# Altium schematic sheet MAX2871.SchDoc
size A4
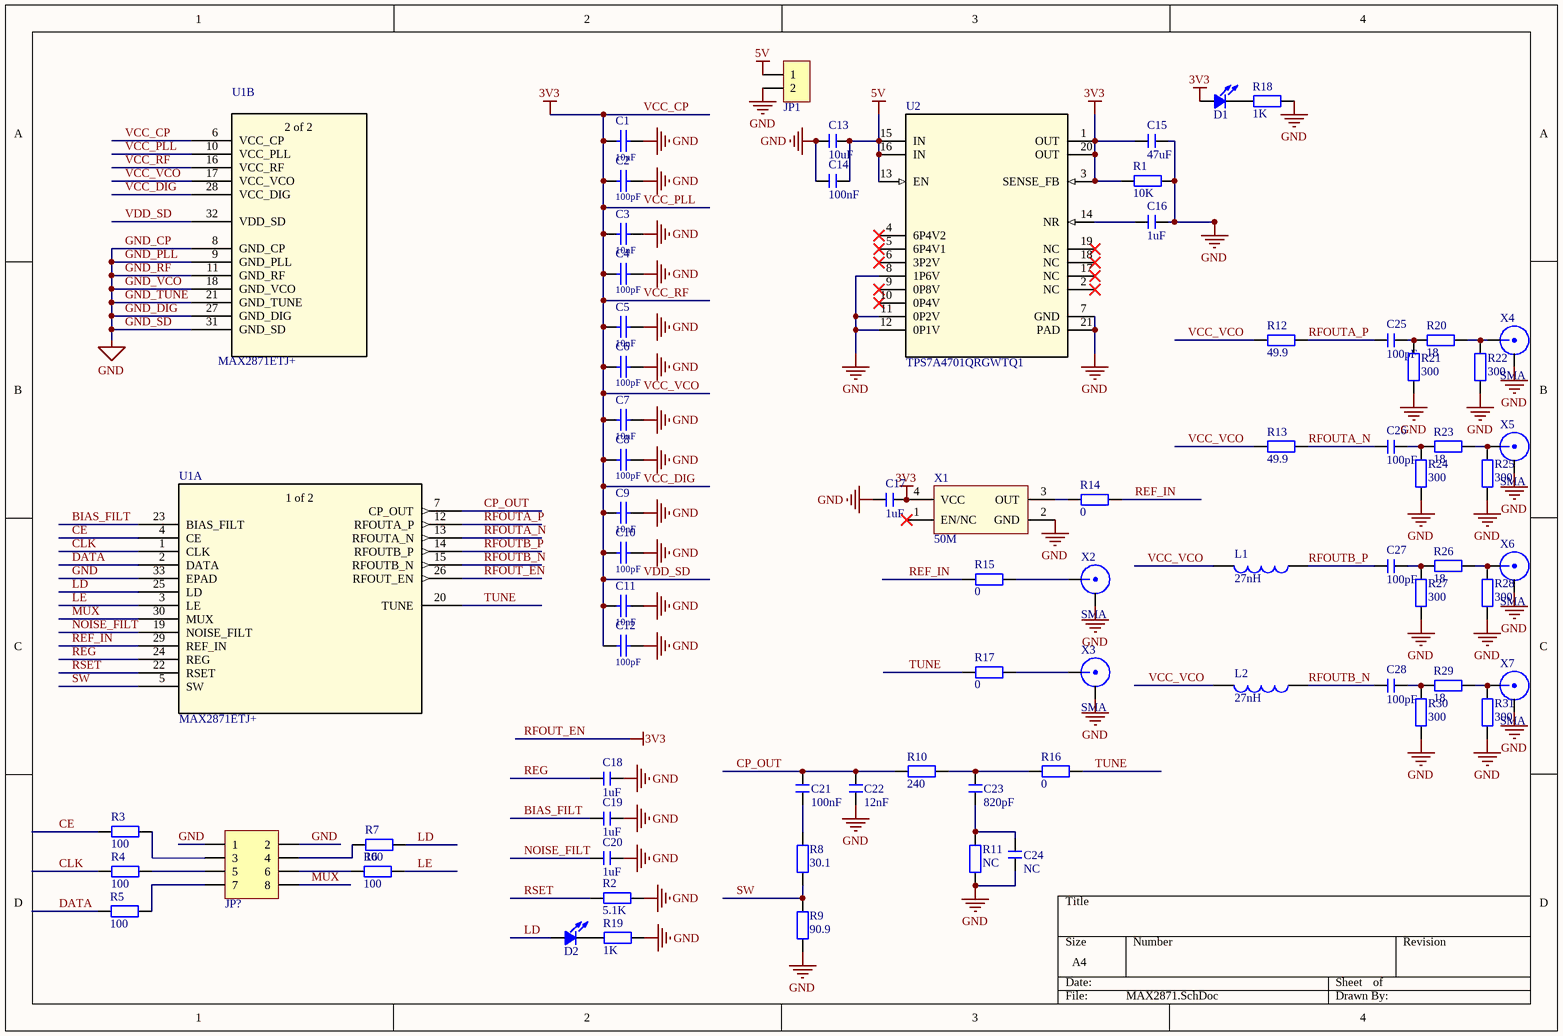
[diagram p0: MAX2871.SchDoc]

## Parts
C1  value 10nF  [C0603-L]  (hidden comment: Cap-S)
C2  value 100pF  [C0603-L]  (hidden comment: Cap-S)
C3  value 10nF  [C0603-L]  (hidden comment: Cap-S)
C4  value 100pF  [C0603-L]  (hidden comment: Cap-S)
C5  value 10nF  [C0603-L]  (hidden comment: Cap-S)
C6  value 100pF  [C0603-L]  (hidden comment: Cap-S)
C7  value 10nF  [C0603-L]  (hidden comment: Cap-S)
C8  value 100pF  [C0603-L]  (hidden comment: Cap-S)
C9  value 10nF  [C0603-L]  (hidden comment: Cap-S)
C10  value 100pF  [C0603-L]  (hidden comment: Cap-S)
C11  value 10nF  [C0603-L]  (hidden comment: Cap-S)
C12  value 100pF  [C0603-L]  (hidden comment: Cap-S)
C13  10uF  [C 0603_L]
C14  100nF  [C 0603_L]
C15  47uF  [C 0603_L]
C16  1uF  [C 0603_L]
C17  1uF  [C 0603_L]
C18  1uF  [C 0603_L]
C19  1uF  [C 0603_L]
C20  1uF  [C 0603_L]
C21  100nF  [C 0603_L]
C22  12nF  [C 0603_L]
C23  820pF  [C 0603_L]
C24  NC  [C 0603_L]
C25  100pF  [C 0603_L]
C26  100pF  [C 0603_L]
C27  100pF  [C 0603_L]
C28  100pF  [C 0603_L]
D1  LED  [Led-0805_L]  (value not drawn)
D2  LED  [Led-0805_L]  (value not drawn)
JP1  HDR-1X2  [VH3.96-LI-2P]  (value not drawn)
JP?  Header 4X2  [HDR2.54-LI-2x4P]  (value not drawn)
L1  27nH  [L 0603]
L2  27nH  [L 0603]
R1  10K  [R 0603_L]
R2  5.1K  [R 0603_L]
R3  100  [R 0603_L]
R4  100  [R 0603_L]
R5  100  [R 0603_L]
R6  100  [R 0603_L]
R7  100  [R 0603_L]
R8  30.1  [R 0603_L]
R9  90.9  [R 0603_L]
R10  240  [R 0603_L]
R11  NC  [R 0603_L]
R12  49.9  [R 0603_L]
R13  49.9  [R 0603_L]
R14  0  [R 0603_L]
R15  0  [R 0603_L]
R16  0  [R 0603_L]
R17  0  [R 0603_L]
R18  1K  [R 0603_L]
R19  1K  [R 0603_L]
R20  18  [R 0603_L]
R21  300  [R 0603_L]
R22  300  [R 0603_L]
R23  18  [R 0603_L]
R24  300  [R 0603_L]
R25  300  [R 0603_L]
R26  18  [R 0603_L]
R27  300  [R 0603_L]
R28  300  [R 0603_L]
R29  18  [R 0603_L]
R30  300  [R 0603_L]
R31  300  [R 0603_L]
U1  MAX2871ETJ+  [21-0140L_T3255-5_MXM]  (parts A,B of 2)
U2  TPS7A4701QRGWTQ1  [RGW0020A]
X1  50M  [OSC 5032-4P]
X2  SMA  [SMA1]
X3  SMA  [SMA1]
X4  SMA  [SMA1]
X5  SMA  [SMA1]
X6  SMA  [SMA1]
X7  SMA  [SMA1]

## Nets
5V: C13.2 C14.2 JP1.1 U2.13(EN) U2.15(IN) U2.16(IN)
GND: C1.2 C2.2 C3.2 C4.2 C5.2 C6.2 C7.2 C8.2 C9.2 C10.2 C11.2 C12.2 C13.1 C14.1 C15.2 C16.2 C17.1 C18.2 C19.2 C20.2 C22.1 C24.1 JP1.2 JP?.1 JP?.2 R1.1 R2.1 R9.2 R11.2 R18.1 R19.1 R21.2 R22.2 R24.2 R25.2 R27.2 R28.2 R30.2 R31.2 U1.8(GND_CP) U1.9(GND_PLL) U1.11(GND_RF) U1.18(GND_VCO) U1.21(GND_TUNE) U1.27(GND_DIG) U1.31(GND_SD) U1.33(EPAD) U2.7(GND) U2.8(1P6V) U2.11(0P2V) U2.12(0P1V) U2.21(PAD) X1.2(GND) X2.2 X3.2 X4.2 X5.2 X6.2 X7.2  [also labelled GND_CP, GND_DIG, GND_PLL, GND_RF, GND_SD, GND_TUNE, GND_VCO]
RFOUT_EN: C1.1 C2.1 C3.1 C4.1 C5.1 C6.1 C7.1 C8.1 C9.1 C10.1 C11.1 C12.1 C15.1 C17.2 D1.1 L1.2 L2.2 R1.2 R12.2 R13.2 U1.6(VCC_CP) U1.10(VCC_PLL) U1.16(VCC_RF) U1.17(VCC_VCO) U1.26(RFOUT_EN) U1.28(VCC_DIG) U1.32(VDD_SD) U2.1(OUT) U2.3(SENSE_FB) U2.20(OUT) X1.4(VCC)  [also labelled 3V3, VCC_CP, VCC_DIG, VCC_PLL, VCC_RF, VCC_VCO, VDD_SD]
BIAS_FILT: C19.1 U1.23(BIAS_FILT)
CE: R3.2 U1.4(CE)
CLK: R4.2 U1.1(CLK)
CP_OUT: C21.2 C22.2 R10.2 U1.7(CP_OUT)
DATA: R5.2 U1.2(DATA)
LD: D2.1 R7.1 U1.25(LD)
LE: R6.1 U1.3(LE)
MUX: JP?.8 U1.30(MUX)
NOISE_FILT: C20.1 U1.19(NOISE_FILT)
REF_IN: R14.1 R15.2 U1.29(REF_IN)
REG: C18.1 U1.24(REG)
RFOUTA_N: C26.1 R13.1 U1.13(RFOUTA_N)
RFOUTA_P: C25.1 R12.1 U1.12(RFOUTA_P)
RFOUTB_N: C28.1 L2.1 U1.15(RFOUTB_N)
RFOUTB_P: C27.1 L1.1 U1.14(RFOUTB_P)
RSET: R2.2 U1.22(RSET)
SW: R8.2 R9.1 U1.5(SW)
TUNE: R16.1 R17.2 U1.20(TUNE)
NetC16_1: C16.1 U2.14(NR)
NetC21_1: C21.1 R8.1
NetC23_1: C23.1 C24.2 R11.1
NetC23_2: C23.2 R10.1 R16.2
NetC25_2: C25.2 R20.2 R21.1
NetC26_2: C26.2 R23.2 R24.1
NetC27_2: C27.2 R26.2 R27.1
NetC28_2: C28.2 R29.2 R30.1
NetD1_2: D1.2 R18.2
NetD2_2: D2.2 R19.2
NetJP?_3: JP?.3 R3.1
NetJP?_4: JP?.4 R7.2
NetJP?_5: JP?.5 R4.1
NetJP?_6: JP?.6 R6.2
NetJP?_7: JP?.7 R5.1
NetR14_2: R14.2 X1.3(OUT)
NetR15_1: R15.1 X2.1
NetR17_1: R17.1 X3.1
NetR20_1: R20.1 R22.1 X4.1
NetR23_1: R23.1 R25.1 X5.1
NetR26_1: R26.1 R28.1 X6.1
NetR29_1: R29.1 R31.1 X7.1

Not connected (* = marked no-connect by the designer): U2 2(NC)* 4(6P4V2)* 5(6P4V1)* 6(3P2V)* 9(0P8V)* 10(0P4V)* 17(NC)* 18(NC)* 19(NC)*; X1 1(EN/NC)*

## Notes on the sheet
- (in symbol MAX2871ETJ+, part A) 1 of 2
- (in symbol MAX2871ETJ+, part B) 2 of 2

## Library data of the parts
C1-C12 = Cap-S: 贴片瓷片电容
C13-C28 = C: 无极性贴片电容; 版权归属: 源创客; BOM名称: 无极性贴片电容; 学习资源: www.ooocke.com
D1 D2 = LED: 发光二极管
JP1 = Header 2_1: 2P接插件; 版权归属: 源创客; BOM名称: 2P接插件; 学习资源: www.ooocke.com
JP? = Header 4X2: 4*2P接插件; 版权归属: 源创客; BOM名称: 4*2P接插件; 学习资源: www.ooocke.com
L1 L2 = L: 小功率贴片电感; 版权归属: 源创客; BOM名称: 小功率贴片电感; 学习资源: www.ooocke.com
R1-R31 = R: 贴片电阻; 版权归属: 源创客; BOM名称: 贴片电阻; 学习资源: www.ooocke.com
U1 = MAX2871ETJ+: No Description Available; Mfr_Name: Maxim Integrated Products; Copyright: Copyright (C) 2021 Ultra Librarian. All rights reserved.; Manufacturer_Part_Number: MAX2871ETJ+; RefDes: RefDes; Type: DEV
U2 = TPS7A4701QRGWTQ1: No Description Available; Manufacturer: Texas Instruments; PartNumber: TPS7A4701QRGWRQ1; RefDes: RefDes; Type: DEV; Value: Value; Copyright: Copyright (C) 2021 Accelerated Designs. All rights reserved
X1 = XTAL-ACT-4P: 4脚有源晶振; 版权归属: 源创客; BOM名称: 4脚有源晶振; 学习资源: www.ooocke.com